# EAGLE schematic Jumping Ring Board (EAGLE 7.3.0)
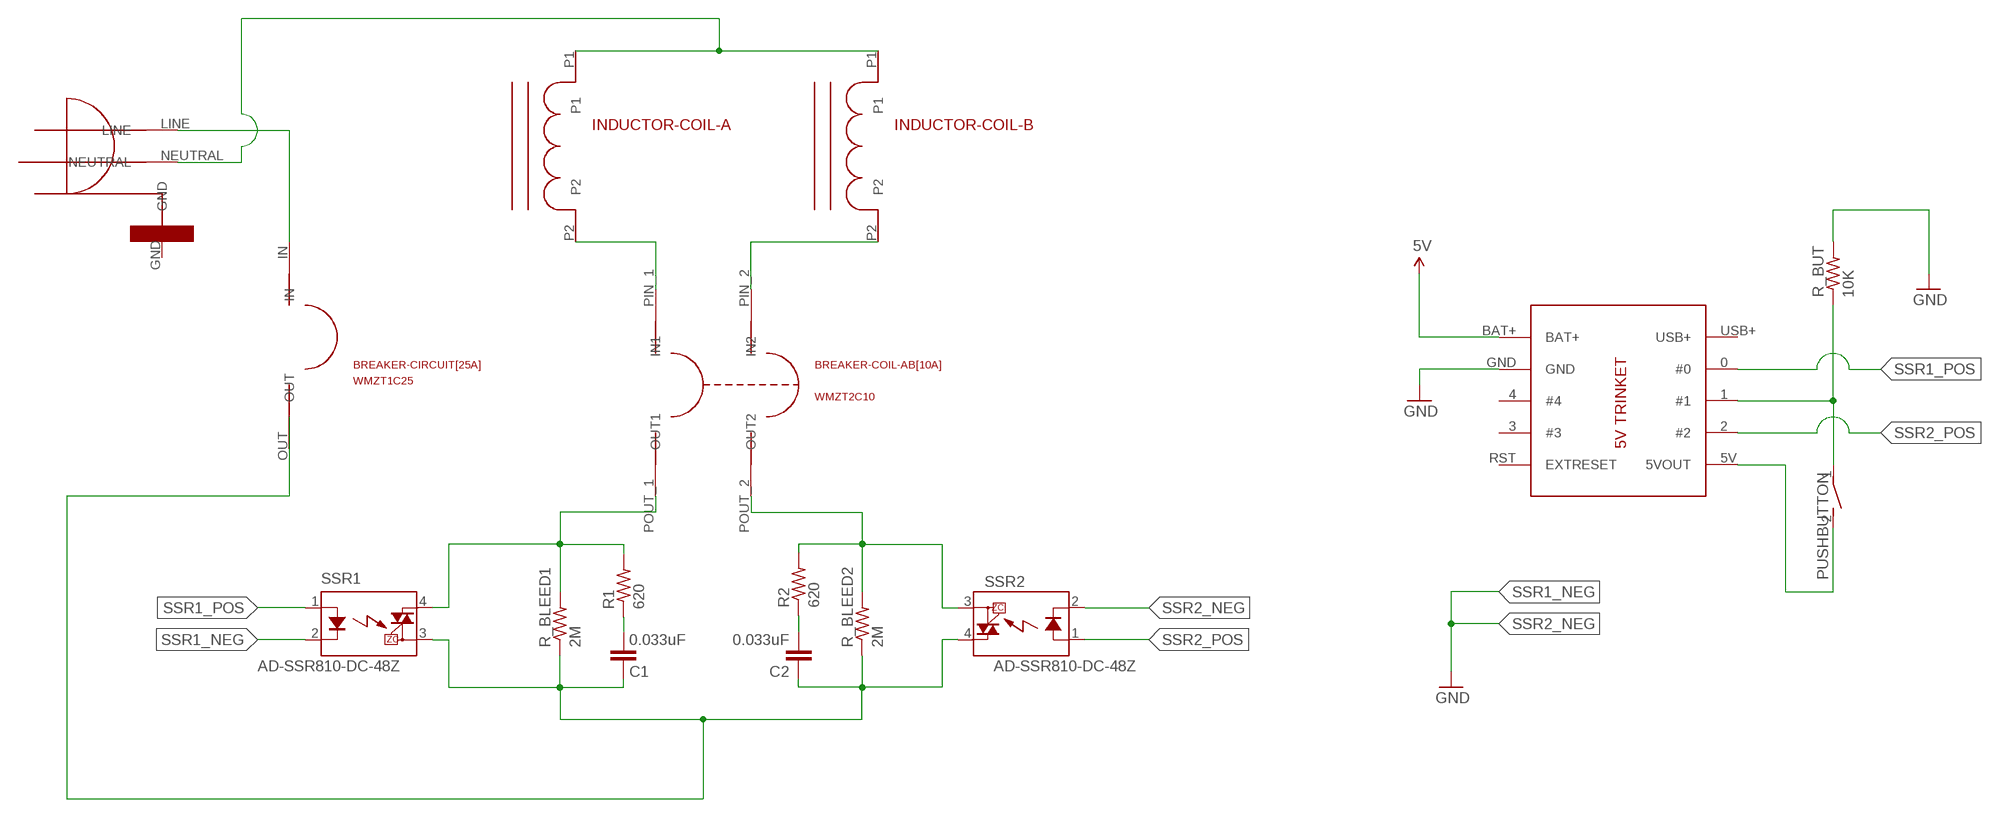
[diagram p0: schematic, sheet 1]

## Parts
BREAKER-CIRCUIT[25A]  WMZT1C25  WMZT-1P  [WMZT-1P]
BREAKER-COIL-AB[10A]  WMZT2C10  WMZT-2P  [WMZT-2P]
C1  0.033uF  C5/2.5  [C5B2.5]
C2  0.033uF  C5/2.5  [C5B2.5]
INDUCTOR-COIL-A  IRON-CORE-INDUCTOR-COIL  [INDUCTOR-PADS]
INDUCTOR-COIL-B  IRON-CORE-INDUCTOR-COIL  [INDUCTOR-PADS]
PUSHBUTTON  DS01E  [DS-01]
R1  620  R-US_0204/7  [0204/7]
R2  620  R-US_0204/7  [0204/7]
R_BLEED1  2M  R-US_0204/7  [0204/7]
R_BLEED2  2M  R-US_0204/7  [0204/7]
R_BUT  10K  R-US_0204/7  [0204/7]
SSR1  AD-SSR810-DC-48Z  ATP1211SZ  [SOP04]
SSR2  AD-SSR810-DC-48Z  ATP1211SZ  [SOP04]
U$1  TRINKET5V  [TRINKET5V]
U$2  AC-SOURCE  [AC-SOURCE]

## Nets
5V: U$1.BAT+
GND: R_BUT.2 U$1.GND
N$1: PUSHBUTTON.1 R_BUT.1 U$1.1(#1)
N$2: BREAKER-CIRCUIT[25A].IN U$2.LINE
N$3: C1.1 C2.1 R_BLEED1.1 R_BLEED2.1 SSR1.3(DS2) SSR2.4(DS1)
N$4: BREAKER-COIL-AB[10A].PIN_1(IN1) INDUCTOR-COIL-A.P2
N$5: BREAKER-COIL-AB[10A].PIN_2(IN2) INDUCTOR-COIL-B.P2
N$6: C1.2 R1.1
N$7: BREAKER-COIL-AB[10A].POUT_2(OUT2) R2.2 R_BLEED2.2 SSR2.3(DS2)
N$8: PUSHBUTTON.2 U$1.5V(5VOUT)
N$9: BREAKER-COIL-AB[10A].POUT_1(OUT1) R1.2 R_BLEED1.2 SSR1.4(DS1)
N$10: C2.2 R2.1
N$13: INDUCTOR-COIL-A.P1 INDUCTOR-COIL-B.P1 U$2.NEUTRAL
SSR1_NEG: SSR1.2(K)
SSR1_POS: SSR1.1(A) U$1.0(#0)
SSR2_NEG: SSR2.2(K) ; supply symbol labelled GND
SSR2_POS: SSR2.1(A) U$1.2(#2)
Unconnected: BREAKER-CIRCUIT[25A].OUT U$1.3(#3) U$1.4(#4) U$1.RST(EXTRESET) U$1.USB+ U$2.GND

## Library data of the parts
BREAKER-CIRCUIT[25A] = WMZT-1P:WMZT-1P
BREAKER-COIL-AB[10A] = WMZT-2P:WMZT-2P
C1 C2 = capacitor-wima:C: CAPACITOR naming: grid - package width
INDUCTOR-COIL-A INDUCTOR-COIL-B = IRON-CORE-INDUCTOR-COIL:IRON-CORE-INDUCTOR-COIL
PUSHBUTTON = switch-dil:DS01E: DIL/CODE SWITCH; OC_FARNELL: unknown; OC_NEWARK: unknown
R1 R2 R_BLEED1 R_BLEED2 R_BUT = adafruit:R-US_: RESISTOR, American symbol
SSR1 SSR2 = relay:ATP1211S*: Phototriac Coupler with Zero-Cross NAiS Source: http://www.mew-europe.com/.. en_ds_61690_0000.pdf; OC_FARNELL: unknown; OC_NEWARK: unknown
U$1 = Trinket:TRINKET5V
U$2 = AC-SOURCE:AC-SOURCE